# Altium project Charging_PCB.PrjPcb (part 2 of 2)

## Sheet 7-Latching IMD.SchDoc
size A
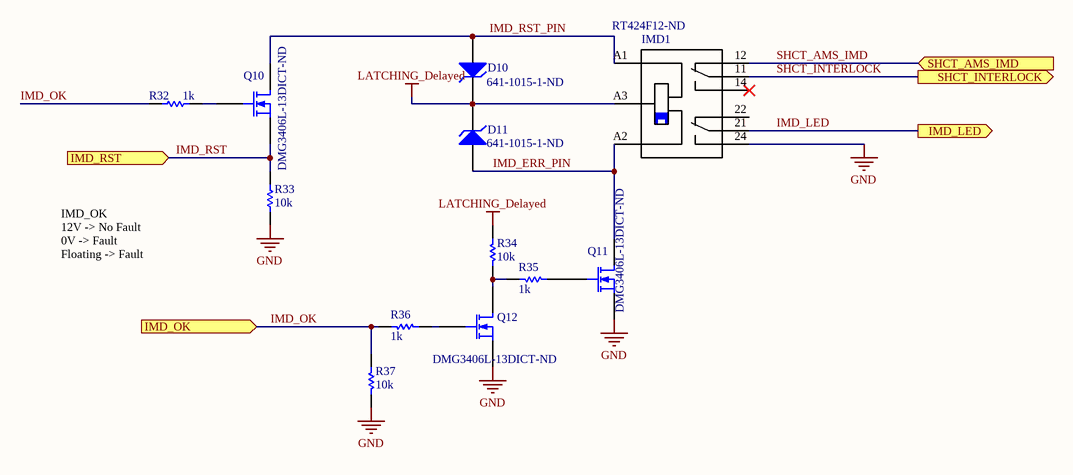
[diagram p6: 7-Latching IMD.SchDoc]

### Parts
D10  Supplier Part Number 1: 641-1015-1-ND  [DO214AC]  (hidden comment: D Zener)
D11  Supplier Part Number 1: 641-1015-1-ND  [DO214AC]  (hidden comment: D Zener)
IMD1  Supplier Part Number 1: RT424F12-ND  [TE_5-1393243-4]  (hidden comment: 5-1393243-4)
Q10  Supplier Part Number 1: DMG3406L-13DICT-ND  [SOT-23_N]
Q11  Supplier Part Number 1: DMG3406L-13DICT-ND  [SOT-23_N]
Q12  Supplier Part Number 1: DMG3406L-13DICT-ND  [SOT-23_N]
R32  value 1k  [1608[0603]]  (hidden comment: Res1)
R33  value 10k  [1608[0603]]  (hidden comment: Res1)
R34  Resistance (Ohms): 10k  [1608[0603]]  (hidden comment: RHM1.0KDCT-ND)
R35  value 1k  [1608[0603]]  (hidden comment: Res1)
R36  value 1k  [1608[0603]]  (hidden comment: Res1)
R37  value 10k  [1608[0603]]  (hidden comment: Res1)

### Ports
IMD_LED (out), IMD_OK (in), IMD_RST (in), SHCT_AMS_IMD (in), SHCT_INTERLOCK (out)

### Nets
GND: IMD1.24 Q11.2(S) Q12.2(S) R33.1 R37.2
LATCHING_Delayed: D10.2(K) D11.2(K) IMD1.A3 R34.1
IMD_ERR_PIN: D11.1(A) IMD1.A2 Q11.3(D)
IMD_LED: IMD1.21 ; port IMD_LED
IMD_OK: R32.1 R36.2 R37.1 ; port IMD_OK
IMD_RST: Q10.2(S) R33.2 ; port IMD_RST
IMD_RST_PIN: D10.1(A) IMD1.A1 Q10.3(D)
SHCT_AMS_IMD: IMD1.12 ; port SHCT_AMS_IMD
SHCT_INTERLOCK: IMD1.11 ; port SHCT_INTERLOCK
NetQ10_1: Q10.1(G) R32.2
NetQ11_1: Q11.1(G) R35.1
NetQ12_1: Q12.1(G) R36.1
NetQ12_3: Q12.3(D) R34.2 R35.2

Not connected (* = marked no-connect by the designer): IMD1 14* 22

### Notes on the sheet
- IMD_OK
  12V -> No Fault
  0V -> Fault
  Floating -> Fault

### Library data of the parts
D10 D11 = D Zener: Zener Diode; Published: 8-Jun-2000; LatestRevisionDate: 17-Jul-2002; LatestRevisionNote: Re-released for DXP Platform.; PackageReference: DIODE-0.7; Publisher: Altium Limited; PackageDescription: Diode, Thru-Hole; 2 Leads; 0.7 in Pin Spacing; Supplier 1: Digi-Key
IMD1 = 5-1393243-4: Electromechanical Relay 12VDC 240Ohm 15A DPDT __ 29mm 12.7mm 15.7mm__ THT Power Relay; MF: TE Connectivity; TE_purchase_URL: https://www.te.com/usa-en/product-5-1393243-4.html?te_bu=Cor&te_type=disp&te_campaign=seda_glo_cor-seda-global-disp-prtnr-fy19-seda-model-bom-cta_sma-317_1&elqCampaignId=32493; Package: None; MP: 5-1393243-4; Digi-Key_Purchase_URL: *; Digi-Key_Part_Number: *; SnapEDA_Link: https://www.snapeda.com/parts/5-1393243-4/TE%20Connectivity/view-part/?ref=snap; Value: *; Supplier 1: Digi-Key
Q10-Q12 = MOSFET-N: N-Channel MOSFET; Manufacturer: Infineon Technologies; FET Type: MOSFET N-Channel, Metal Oxide; FET Feature: Logic Level Gate; Drain to Source Voltage (Vdss): 30V; Current - Continuous Drain (Id) @ 25°C: 50A (Tc); Rds On (Max) @ Id, Vgs: 7.5 mOhm @ 30A, 10V; Vgs(th) (Max) @ Id: 2.2V @ 250µA; Gate Charge (Qg) @ Vgs: 18nC @ 10V; Input Capacitance (Ciss) @ Vds: 1900pF @ 15V; Power - Max: 47W; Published: 8-Jun-2000; LatestRevisionDate: 17-Jul-2002; LatestRevisionNote: Re-released for DXP Platform.; PackageVersion: 1995/1996; PackageReference: E3; Publisher: Altium Limited; PackageDescription: TO, Flat Index; 3 In-Line, Axial Leads; Body Dia. 4.6mm; Lead Dia. 0.5 mm (max); RoHS: RoHS Compliant; Category: Discrete Semiconductor Products; Packaging: Cut Tape (CT); Mounting Type: Surface Mount; Package / Case: TO-252-3, DPak (2 Leads + Tab), SC-63; Supplier Device Package: PG-TO252-3; ComponentLink1URL: http://www.infineon.com/dgdl/Infineon-IPD075N03LG-DS-v02_01-en.pdf?folderId=5546d4694909da4801490a07012f053b&fileId=db3a30431936bc4b011951d824f83aeb; ComponentLink1Description: http://www.infineon.com/dgdl/Infineon-IPD075N03LG-DS-v02_01-en.pdf?folderId=5546d4694909da4801490a07012f053b&fileId=db3a30431936bc4b011951d824f83aeb; ComponentLink2URL: http://www.semicon.toshiba.co.jp/info/docget.jsp?type=datasheet&lang=en&pid=SSM3K329R; ComponentLink2Description: http://www.semicon.toshiba.co.jp/info/docget.jsp?type=datasheet&lang=en&pid=SSM3K329R; Supplier 1: Digi-Key
R32 R35 R36 = Res1: RES SMD 100 OHM 5% 1/4W 0603; Manufacturer: Rohm Semiconductor; Manufacturer Part Number: ESR03EZPJ101; Resistance (Ohms): 100; Power (Watts): 0.25W, 1/4W; Temperature Coefficient: ±200ppm/°C; Published: 8-Jun-2000; LatestRevisionDate: 17-Jul-2002; LatestRevisionNote: Re-released for DXP Platform.; PackageReference: AXIAL-0.3; Publisher: Altium Limited; PackageDescription: Axial Device, Thru-Hole; 2 Leads; 0.3 in Pin Spacing; Supplier 1: Digi-Key; Supplier Part Number 1: RHM100DCT-ND; RoHS: RoHS Compliant; Category: Resistors; Stock 1: 57430; Pricing 1: 1=0.15, 10=0.119, 25=0.0824, 50=0.0642, 100=0.0458, 250=0.03568, 500=0.02836, 1000=0.02012 (CAD); Packaging: Cut Tape (CT); Part Status: Active; Tolerance: ±5%; Composition: Thick Film; Features: Automotive AEC-Q200, Pulse Withstanding; Operating Temperature: -55°C ~ 155°C; Package / Case: 0603 (1608 Metric); Supplier Device Package: 0603; Size / Dimension: 0.063" L x 0.031" W (1.60mm x 0.80mm); Height - Seated (Max): 0.022" (0.55mm); Failure Rate: -; ComponentLink1URL: http://rohmfs.rohm.com/en/products/databook/datasheet/passive/resistor/chip_resistor/esr.pdf; ComponentLink1Description: http://rohmfs.rohm.com/en/products/databook/datasheet/passive/resistor/chip_resistor/esr.pdf
R33 = Res1: RES SMD 10K OHM 5% 1/4W 0603; Manufacturer: Rohm Semiconductor; Manufacturer Part Number: ESR03EZPJ103; Power (Watts): 0.25W, 1/4W; Temperature Coefficient: ±200ppm/°C; Published: 8-Jun-2000; LatestRevisionDate: 17-Jul-2002; LatestRevisionNote: Re-released for DXP Platform.; PackageReference: AXIAL-0.3; Publisher: Altium Limited; PackageDescription: Axial Device, Thru-Hole; 2 Leads; 0.3 in Pin Spacing; Supplier 1: Digi-Key; Supplier Part Number 1: RHM10KDCT-ND; RoHS: RoHS Compliant; Category: Resistors; Stock 1: 0; Pricing 1: 1=0.15, 10=0.119, 25=0.0824, 50=0.0642, 100=0.0458, 250=0.03568, 500=0.02836, 1000=0.02012 (CAD); Packaging: Cut Tape (CT); Resistance (Ohms): 10k; Tolerance: ±5%; Composition: Thick Film; Features: Automotive AEC-Q200, Pulse Withstanding; Operating Temperature: -55°C ~ 155°C; Package / Case: 0603 (1608 Metric); Supplier Device Package: 0603 (1608 Metric); Size / Dimension: 0.063" L x 0.031" W (1.60mm x 0.80mm); Height: 0.022" (0.55mm); Number of Terminations: 2; ComponentLink1URL: http://rohmfs.rohm.com/en/products/databook/datasheet/passive/resistor/chip_resistor/esr.pdf; ComponentLink1Description: http://rohmfs.rohm.com/en/products/databook/datasheet/passive/resistor/chip_resistor/esr.pdf; Part Status: Active; Height - Seated (Max): 0.022" (0.55mm); Failure Rate: -
R34 = Res1: RES SMD 1.0K OHM 5% 1/4W 0603; Manufacturer: Rohm Semiconductor; Manufacturer Part Number: ESR03EZPJ102; Power (Watts): 0.25W, 1/4W; Temperature Coefficient: ±200ppm/°C; Supplier 1: Digi-Key; Supplier Part Number 1: RHM1.0KDCT-ND; RoHS: RoHS Compliant; Category: Resistors; Stock 1: 220; Pricing 1: 1=0.15, 10=0.119, 25=0.0824, 50=0.0642, 100=0.0458, 250=0.03568, 500=0.02836, 1000=0.02012 (CAD); Packaging: Cut Tape (CT); Part Status: Active; Tolerance: ±5%; Composition: Thick Film; Features: Automotive AEC-Q200, Pulse Withstanding; Operating Temperature: -55°C ~ 155°C; Package / Case: 0603 (1608 Metric); Supplier Device Package: 0603; Size / Dimension: 0.063" L x 0.031" W (1.60mm x 0.80mm); Height - Seated (Max): 0.022" (0.55mm); Failure Rate: -; ComponentLink1URL: http://rohmfs.rohm.com/en/products/databook/datasheet/passive/resistor/chip_resistor/esr.pdf; ComponentLink1Description: http://rohmfs.rohm.com/en/products/databook/datasheet/passive/resistor/chip_resistor/esr.pdf
R37 = Res1: RES SMD 2.2K OHM 5% 1/4W 0603; Manufacturer: Rohm Semiconductor; Manufacturer Part Number: ESR03EZPJ222; Power (Watts): 0.25W, 1/4W; Temperature Coefficient: ±200ppm/°C; Published: 8-Jun-2000; LatestRevisionDate: 17-Jul-2002; LatestRevisionNote: Re-released for DXP Platform.; PackageReference: AXIAL-0.3; Publisher: Altium Limited; PackageDescription: Axial Device, Thru-Hole; 2 Leads; 0.3 in Pin Spacing; Supplier 1: Digi-Key; Supplier Part Number 1: RHM2.2KDCT-ND; RoHS: RoHS Compliant; Category: Resistors; Stock 1: 17564; Pricing 1: 1=0.15, 10=0.121, 25=0.0832, 100=0.0463, 250=0.03604, 500=0.02866, 1000=0.02033 (CAD); Packaging: Cut Tape (CT); Resistance (Ohms): 2.2k; Tolerance: ±5%; Composition: Thick Film; Features: Automotive AEC-Q200, Pulse Withstanding; Operating Temperature: -55°C ~ 155°C; Package / Case: 0603 (1608 Metric); Supplier Device Package: 0603 (1608 Metric); Size / Dimension: 0.063" L x 0.031" W (1.60mm x 0.80mm); Height: 0.022" (0.55mm); Number of Terminations: 2; ComponentLink1URL: http://rohmfs.rohm.com/en/products/databook/datasheet/passive/resistor/chip_resistor/esr.pdf; ComponentLink1Description: http://rohmfs.rohm.com/en/products/databook/datasheet/passive/resistor/chip_resistor/esr.pdf

## Sheet 8-Controller.SchDoc
size A; SPICEModelCacheDTLPPUMU: <root> / <DocumentId>DTLPPUMU</DocumentId> / <CacheFrame Number="0"> / <Model Name="xtal" Kind="CKT"> / <Text>*Generic type:crystal pkg:HC33/51 / .SUBCKT XTAL 1 2 PARAMS: FREQ=1Meg RS=750 C=13pf Q=1000 / LX 1 3 {((Q*RS)/(6.2831852*FREQ))} IC=0.5M / CX 3 4 {(1/(Q*6.2831852*FREQ*RS))} / C0 1 2 {C} / RS 4 2 {RS} / .ENDS XTAL</Text> / </Model> / </CacheFrame> / </root>
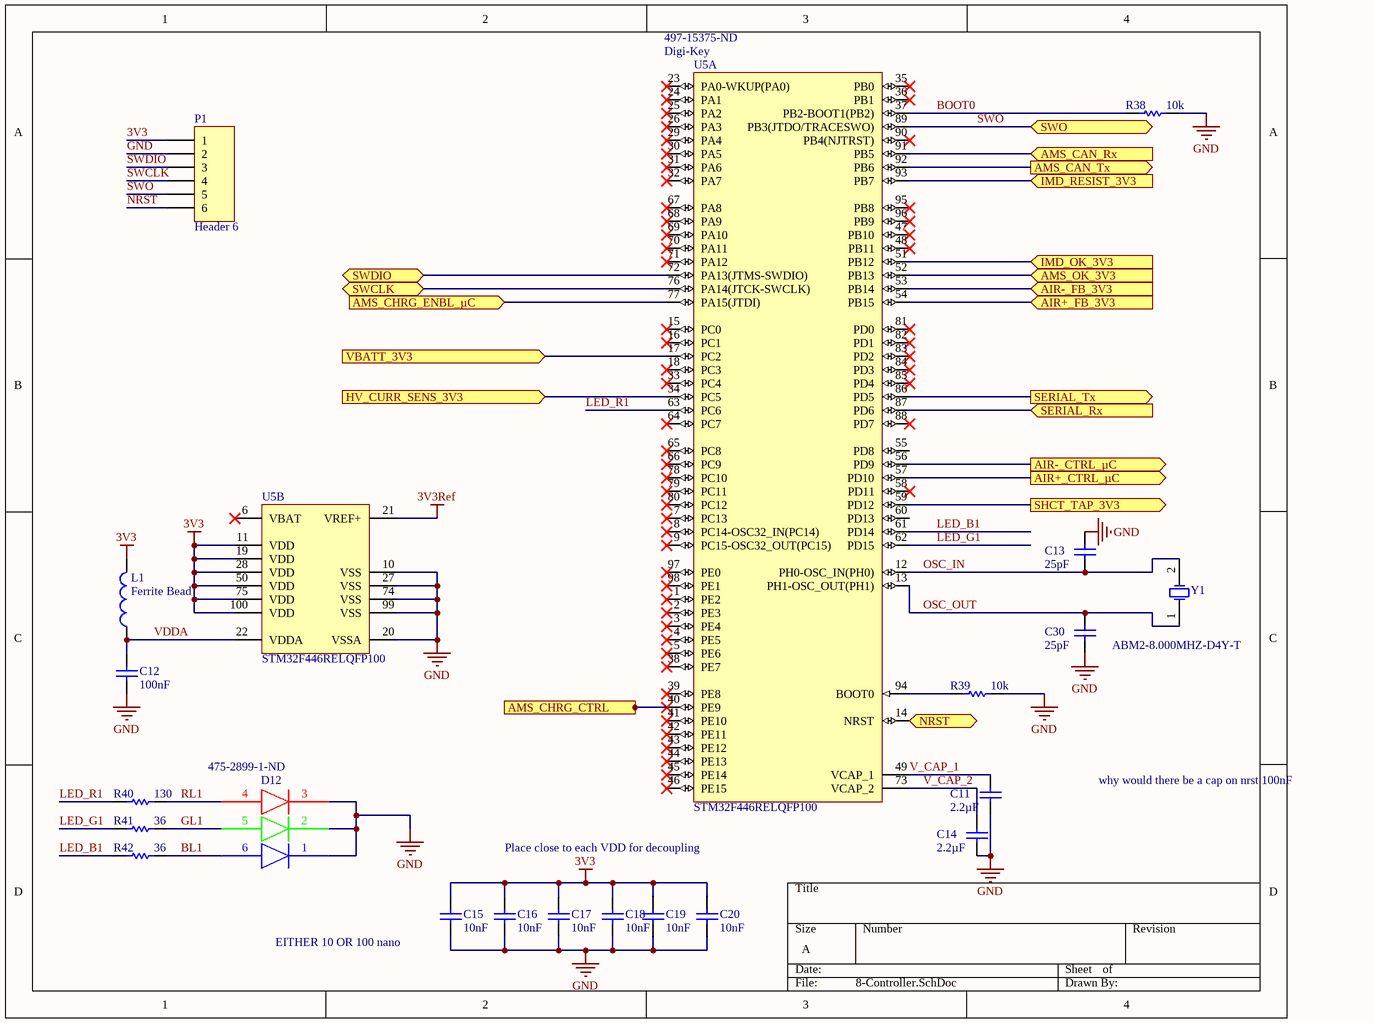
[diagram p7: 8-Controller.SchDoc]

### Parts
C11  Capacitance: 2.2µF  [1608[0603]]  (hidden comment: Cap)
C12  value 100nF  [1608[0603]]  (hidden comment: Cap)
C13  Capacitance: 25pF  [1608[0603]]  (hidden comment: Cap)
C14  Capacitance: 2.2µF  [1608[0603]]  (hidden comment: Cap)
C15  value 10nF  [1608[0603]]  (hidden comment: Cap)
C16  value 10nF  [1608[0603]]  (hidden comment: Cap)
C17  value 10nF  [1608[0603]]  (hidden comment: Cap)
C18  value 10nF  [1608[0603]]  (hidden comment: Cap)
C19  value 10nF  [1608[0603]]  (hidden comment: Cap)
C20  value 10nF  [1608[0603]]  (hidden comment: Cap)
C30  Capacitance: 25pF  [1608[0603]]  (hidden comment: Cap)
D12  Supplier Part Number 1: 475-2899-1-ND  [CLX6C-FKB]
L1  Ferrite Bead  [1608[0603]]
P1  Header 6  [HDR1X6]
R38  value 10k  [1608[0603]]  (hidden comment: Res1)
R39  value 10k  [1608[0603]]  (hidden comment: Res1)
R40  value 130  [1608[0603]]  (hidden comment: Res1)
R41  value 36  [1608[0603]]  (hidden comment: Res1)
R42  value 36  [1608[0603]]  (hidden comment: Res1)
U5  STM32F446RELQFP100  Supplier 1: Digi-Key  Supplier Part Number 1: 497-15375-ND  [STM-LQFP100_L]  (parts A,B of 2)
Y1  ABM2-8.000MHZ-D4Y-T  [ABM2-8.000MHZ-D4Y-T]

### Ports
AIR+_CTRL_µC (out), AIR+_FB_3V3 (in), AIR-_CTRL_µC (out), AIR-_FB_3V3 (in), AMS_CAN_Rx (in), AMS_CAN_Tx (out), AMS_CHRG_CTRL (in), AMS_CHRG_ENBL_µC (in), AMS_OK_3V3 (in), HV_CURR_SENS_3V3 (in), IMD_OK_3V3 (in), IMD_RESIST_3V3 (in), NRST (bidir), SERIAL_Rx (in), SERIAL_Tx (out), SHCT_TAP_3V3 (out), SWCLK (bidir), SWDIO (bidir), SWO (bidir), VBATT_3V3 (in)

### Nets
3V3: C15.2 C16.2 C17.2 C18.2 C19.2 C20.2 L1.2 P1.1 U5.11(VDD) U5.19(VDD) U5.28(VDD) U5.50(VDD) U5.75(VDD) U5.100(VDD)
3V3Ref: U5.21(VREF+)
GND: C11.1 C12.1 C13.2 C14.1 C15.1 C16.1 C17.1 C18.1 C19.1 C20.1 C30.1 D12.1(B) D12.2(G) D12.3(R) P1.2 R38.2 R39.2 U5.10(VSS) U5.20(VSSA) U5.27(VSS) U5.74(VSS) U5.99(VSS)
AMS_CHRG_CTRL: U5.40(PE9) ; port AMS_CHRG_CTRL
BL1: D12.6(B) R42.2
BOOT0: R38.1 U5.37(PB2-BOOT1(PB2))
GL1: D12.5(G) R41.2
LED_B1: R42.1 U5.61(PD14)
LED_G1: R41.1 U5.62(PD15)
LED_R1: R40.1 U5.63(PC6)
NRST: P1.6 U5.14(NRST) ; port NRST
OSC_IN: C13.1 U5.12(PH0-OSC_IN(PH0)) Y1.2(OSC2)
OSC_OUT: C30.2 U5.13(PH1-OSC_OUT(PH1)) Y1.1(OSC1)
RL1: D12.4(R) R40.2
Serial_Rx: U5.87(PD6) ; port SERIAL_Rx
Serial_Tx: U5.86(PD5) ; port SERIAL_Tx
SWCLK: P1.4 U5.76(PA14(JTCK-SWCLK)) ; port SWCLK
SWDIO: P1.3 U5.72(PA13(JTMS-SWDIO)) ; port SWDIO
SWO: P1.5 U5.89(PB3(JTDO/TRACESWO)) ; port SWO
V_CAP_1: C11.2 U5.49(VCAP_1)
V_CAP_2: C14.2 U5.73(VCAP_2)
VDDA: C12.2 L1.1 U5.22(VDDA)
NetC21_2: U5.34(PC5) ; port HV_CURR_SENS_3V3
NetC22_2: U5.51(PB12) ; port IMD_OK_3V3
NetC23_2: U5.52(PB13) ; port AMS_OK_3V3
NetC24_2: U5.93(PB7) ; port IMD_RESIST_3V3
NetC25_2: U5.17(PC2) ; port VBATT_3V3
NetC26_2: U5.59(PD12) ; port SHCT_TAP_3V3
NetC27_2: U5.54(PB15) ; port AIR+_FB_3V3
NetC28_2: U5.53(PB14) ; port AIR-_FB_3V3
NetR13_1: U5.57(PD10) ; port AIR+_CTRL_µC
NetR15_1: U5.56(PD9) ; port AIR-_CTRL_µC
NetR39_1: R39.1 U5.94(BOOT0)
NetU5_77: U5.77(PA15(JTDI)) ; port AMS_CHRG_ENBL_µC
NetU5_91: U5.91(PB5) ; port AMS_CAN_Rx
NetU5_92: U5.92(PB6) ; port AMS_CAN_Tx

Not connected (* = marked no-connect by the designer): U5 1(PE2)* 2(PE3)* 3(PE4)* 4(PE5)* 5(PE6)* 6(VBAT)* 7(PC13)* 8(PC14-OSC32_IN(PC14))* 9(PC15-OSC32_OUT(PC15))* 15(PC0)* 16(PC1)* 18(PC3)* 23(PA0-WKUP(PA0))* 24(PA1)* 25(PA2)* 26(PA3)* 29(PA4)* 30(PA5)* 31(PA6)* 32(PA7)* 33(PC4)* 35(PB0)* 36(PB1)* 38(PE7)* 39(PE8)* 41(PE10)* 42(PE11)* 43(PE12)* 44(PE13)* 45(PE14)* 46(PE15)* 47(PB10)* 48(PB11)* 55(PD8) 58(PD11)* 60(PD13) 64(PC7)* 65(PC8)* 66(PC9)* 67(PA8)* 68(PA9)* 69(PA10)* 70(PA11)* 71(PA12)* 78(PC10)* 79(PC11)* 80(PC12)* 81(PD0)* 82(PD1)* 83(PD2)* 84(PD3)* 85(PD4)* 88(PD7)* 90(PB4(NJTRST))* 95(PB8)* 96(PB9)* 97(PE0)* 98(PE1)*

### Notes on the sheet
- why would there be a cap on nrst 100nF
- Place close to each VDD for decoupling
- (near C15) EITHER 10 OR 100 nano

### Library data of the parts
C11 C13 C14 C30 = Cap: Capacitor; Manufacturer: Taiyo Yuden; Manufacturer Part Number: TMK107BBJ225KAHT; Tolerance: ±10%; Voltage - Rated: 25V; Temperature Coefficient: X5R; Category: Capacitors; Applications: General Purpose; Supplier 1: Digi-Key; Supplier Part Number 1: 587-4333-1-ND; RoHS: RoHS Compliant; Stock 1: 6587; Pricing 1: 1=0.28, 10=0.193, 25=0.1416, 50=0.116, 100=0.0979, 250=0.07992, 500=0.06702, 1000=0.05928 (CAD); Packaging: Cut Tape (CT); Part Status: Active; Operating Temperature: -55°C ~ 85°C; Features: -; Ratings: AEC-Q200; Mounting Type: Surface Mount, MLCC; Package / Case: 0603 (1608 Metric); Size / Dimension: 0.063" L x 0.031" W (1.60mm x 0.80mm); Height - Seated (Max): -; Thickness (Max): 0.035" (0.90mm); Lead Spacing: -; Lead Style: -; ComponentLink1URL: http://www.yuden.co.jp/productdata/catalog/en/mlcc_all_hq_e.pdf; ComponentLink1Description: http://www.yuden.co.jp/productdata/catalog/en/mlcc_all_hq_e.pdf
C12 = Cap: Capacitor; Manufacturer: Yageo; Manufacturer Part Number: CC0603KRX7R9BB104; Capacitance: 0.10µF; Tolerance: ±10%; Voltage - Rated: 50V; Temperature Coefficient: X7R; Supplier 1: Digi-Key; Supplier Part Number 1: 311-1344-1-ND; RoHS: RoHS Compliant; Category: Capacitors; Stock 1: 4016262; Pricing 1: 1=0.15, 10=0.043, 25=0.0312, 50=0.0232, 100=0.0189, 250=0.0158, 500=0.01346, 1000=0.01059 (CAD); Packaging: Cut Tape (CT); Part Status: Active; Operating Temperature: -55°C ~ 125°C; Features: -; Ratings: -; Applications: General Purpose; Failure Rate: -; Mounting Type: Surface Mount, MLCC; Package / Case: 0603 (1608 Metric); Size / Dimension: 0.063" L x 0.031" W (1.60mm x 0.80mm); Height - Seated (Max): -; Thickness (Max): 0.035" (0.90mm); Lead Spacing: -; Lead Style: -; ComponentLink1URL: http://www.yageo.com/documents/recent/UPY-GPHC_X7R_6.3V-to-50V_16.pdf; ComponentLink1Description: http://www.yageo.com/documents/recent/UPY-GPHC_X7R_6.3V-to-50V_16.pdf
C15-C20 = Cap: Capacitor; Manufacturer: Yageo; Manufacturer Part Number: CC0603KRX7R9BB103; Capacitance: 10000pF; Tolerance: ±10%; Voltage - Rated: 50V; Temperature Coefficient: X7R; Supplier 1: Digi-Key; Supplier Part Number 1: 311-1085-1-ND; RoHS: RoHS Compliant; Category: Capacitors; Stock 1: 3577285; Pricing 1: 1=0.15, 10=0.026, 25=0.0192, 50=0.0144, 100=0.0117, 250=0.0098, 500=0.00836, 1000=0.00657 (CAD); Packaging: Cut Tape (CT); Part Status: Active; Operating Temperature: -55°C ~ 125°C; Features: -; Ratings: -; Applications: General Purpose; Failure Rate: -; Mounting Type: Surface Mount, MLCC; Package / Case: 0603 (1608 Metric); Size / Dimension: 0.063" L x 0.031" W (1.60mm x 0.80mm); Height - Seated (Max): -; Thickness (Max): 0.035" (0.90mm); Lead Spacing: -; Lead Style: -; ComponentLink1URL: http://www.yageo.com/documents/recent/UPY-GPHC_X7R_6.3V-to-50V_16.pdf; ComponentLink1Description: http://www.yageo.com/documents/recent/UPY-GPHC_X7R_6.3V-to-50V_16.pdf
D12 = LED - CLX6C-FKB-CGJKNCFBB789363 RGB: Manufacturer: Cree Inc.; Color: Red, Green, Blue (RGB); Lens Color: White; Lens Transparency: Diffused; Millicandela Rating: 420mcd Red, 840mcd Green, 196mcd Blue; Lens Style/Size: Square with Flat Top, 1.00mm; Voltage - Forward (Vf) (Typ): 1.9V Red, 3V Green, 3V Blue; Current - Test: 8mA Red, 8mA Green, 8mA Blue; Wavelength - Dominant: 622nm Red, 531nm Green, 470nm Blue; Manufacturer Part Number: CLX6C-FKB-CGJKNCFBB789363; RoHS: RoHS Compliant; Category: Optoelectronics; Packaging: Cut Tape (CT); Part Status: Active; Viewing Angle: -; Mounting Type: Surface Mount; Wavelength - Peak: -; Features: -; Package / Case: 6-SMD, J-Lead; Supplier Device Package: 6-PLCC; Size / Dimension: 3.40mm L x 3.40mm W; Height (Max): 2.90mm; ComponentLink1URL: http://www.cree.com/~/media/Files/Cree/LED-Components-and-Modules/HB/Data-Sheets/1281-CLX6C-FKB.pdf; ComponentLink1Description: http://www.cree.com/~/media/Files/Cree/LED-Components-and-Modules/HB/Data-Sheets/1281-CLX6C-FKB.pdf; Supplier 1: Digi-Key
L1 = Inductor: Code_IEC: 1005; Published: 8-Jun-2000; LatestRevisionDate: 29-May-2009; LatestRevisionNote: IPC-7351 Footprint Added.; PackageReference: 0402-A; Publisher: Altium Limited; PackageDescription: Chip Inductor; Code_JEITA: 0402; Supplier 1: Digi-Key; Supplier Part Number 1: 240-2369-1-ND
P1 = Header 6: Header, 6-Pin; LatestRevisionDate: 17-Jul-2002; LatestRevisionNote: Re-released for DXP Platform.; Publisher: Altium Limited
R38 R39 = Res1: Resistor; Manufacturer: Yageo; Manufacturer Part Number: RC0603JR-0710KL; Tolerance: ±5%; Power (Watts): 0.1W, 1/10W; Temperature Coefficient: ±100ppm/°C; Supplier 1: Digi-Key; Supplier Part Number 1: 311-10KGRCT-ND; RoHS: RoHS Compliant; Category: Resistors; Stock 1: 2936292; Pricing 1: 1=0.16, 10=0.016, 25=0.0112, 50=0.0084, 100=0.0062, 250=0.0048, 500=0.00382, 1000=0.00281 (CAD); Packaging: Cut Tape (CT); Part Status: Active; Resistance (Ohms): 10k; Composition: Thick Film; Features: Moisture Resistant; Operating Temperature: -55°C ~ 155°C; Package / Case: 0603 (1608 Metric); Supplier Device Package: 0603; Size / Dimension: 0.063" L x 0.031" W (1.60mm x 0.80mm); Height - Seated (Max): 0.022" (0.55mm); Number of Terminations: 2; Failure Rate: -; ComponentLink1URL: http://www.yageo.com/NewPortal/yageodocoutput?fileName=/pdf/R-Chip/PYu-RC_Group_51_RoHS_L_4.pdf; ComponentLink1Description: http://www.yageo.com/NewPortal/yageodocoutput?fileName=/pdf/R-Chip/PYu-RC_Group_51_RoHS_L_4.pdf
R40 = Res1: Resistor; Manufacturer: Yageo; Manufacturer Part Number: RC0603JR-07130RL; Tolerance: ±5%; Power (Watts): 0.1W, 1/10W; Temperature Coefficient: ±100ppm/°C; Supplier 1: Digi-Key; Supplier Part Number 1: 311-130GRCT-ND; RoHS: RoHS Compliant; Category: Resistors; Stock 1: 74185; Pricing 1: 1=0.16, 10=0.016, 25=0.0112, 50=0.0084, 100=0.0062, 250=0.0048, 500=0.00382, 1000=0.00281 (CAD); Packaging: Cut Tape (CT); Part Status: Active; Resistance (Ohms): 130; Composition: Thick Film; Features: Moisture Resistant; Operating Temperature: -55°C ~ 155°C; Package / Case: 0603 (1608 Metric); Supplier Device Package: 0603; Size / Dimension: 0.063" L x 0.031" W (1.60mm x 0.80mm); Height - Seated (Max): 0.022" (0.55mm); Number of Terminations: 2; Failure Rate: -; ComponentLink1URL: http://www.yageo.com/NewPortal/yageodocoutput?fileName=/pdf/R-Chip/PYu-RC_Group_51_RoHS_L_4.pdf; ComponentLink1Description: http://www.yageo.com/NewPortal/yageodocoutput?fileName=/pdf/R-Chip/PYu-RC_Group_51_RoHS_L_4.pdf
R41 R42 = Res1: Resistor; Manufacturer: Yageo; Manufacturer Part Number: RC0603JR-0736RL; Tolerance: ±5%; Power (Watts): 0.1W, 1/10W; Temperature Coefficient: ±100ppm/°C; Supplier 1: Digi-Key; Supplier Part Number 1: 311-36GRCT-ND; RoHS: RoHS Compliant; Category: Resistors; Stock 1: 43300; Pricing 1: 1=0.16, 10=0.016, 25=0.0112, 50=0.0084, 100=0.0062, 250=0.0048, 500=0.00382, 1000=0.00281 (CAD); Packaging: Cut Tape (CT); Part Status: Active; Resistance (Ohms): 36; Composition: Thick Film; Features: Moisture Resistant; Operating Temperature: -55°C ~ 155°C; Package / Case: 0603 (1608 Metric); Supplier Device Package: 0603; Size / Dimension: 0.063" L x 0.031" W (1.60mm x 0.80mm); Height - Seated (Max): 0.022" (0.55mm); Number of Terminations: 2; Failure Rate: -; ComponentLink1URL: http://www.yageo.com/NewPortal/yageodocoutput?fileName=/pdf/R-Chip/PYu-RC_Group_51_RoHS_L_4.pdf; ComponentLink1Description: http://www.yageo.com/NewPortal/yageodocoutput?fileName=/pdf/R-Chip/PYu-RC_Group_51_RoHS_L_4.pdf
U5 = CMP-0243-00042-2: ARM Cortex-M4 32-bit MCU+FPU, 225 DMIPS, 2048 kB Flash, 256 kB Internal RAM, 81 I/Os, 100-pin LQFP, -40 to 85 degC, Tray; PartNumber: STM32F439VIT6; Manufacturer: STMicroelectronics; Manufacturer Part Number: STM32F446VET6; FLASH Size (Prog) (kB): 2048; Supply Voltage(Vcc) max (V): 3.6; I/Os (High Current): 82; Supply Voltage(Vcc) min (V): 1.8; Operating Frequency(F) (Processor speed) (MHz): 180; Internal RAM Size (kB): 256; D/A Converter: 2x12-bit; Core Processor: ARM® Cortex®-M4; Speed: 180MHz; Connectivity: CAN, EBI/EMI, I²C, IrDA, LIN, SAI, SD, SPDIF-Rx, SPI, UART/USART, USB, USB OTG; Peripherals: Brown-out Detect/Reset, DMA, I²S, LVD, POR, PWM, WDT; Number of I/O: 81; Program Memory Size: 512KB (512K x 8); RAM Size: 128K x 8; Voltage - Supply (Vcc/Vdd): 1.7 V ~ 3.6 V; Data Converters: A/D 16x12b, D/A 2x12b; Rule: UNIONINDEX=0|RULEKIND=Clearance|NETSCOPE=DifferentNets|LAYERKIND=SameLayer|NAME=Schematic Clearance Constraint|GAP=10mil|GENERICCLEARANCE=10mil|IGNOREPADTOPADCLEARANCEINFOOTPRINT=FALSE|OBJECTCLEARANCES=ClearanceObj_Arc-ClearanceObj_Hole:0;ClearanceObj_Track-ClearanceObj_Hole:0;ClearanceObj_SMDPad-ClearanceObj_Hole:0;ClearanceObj_THPad-ClearanceObj_Hole:0;ClearanceObj_Via-ClearanceObj_Hole:0;ClearanceObj_Fill-ClearanceObj_Hole:0;ClearanceObj_Poly-ClearanceObj_Hole:0;ClearanceObj_Region-ClearanceObj_Hole:0;ClearanceObj_Text-ClearanceObj_Hole:0|UNIT=Imperial; Rule: UNIONINDEX=0|RULEKIND=Width|NETSCOPE=AnyNet|LAYERKIND=SameLayer|NAME=Schematic Width Constraint|MAXLIMIT=10mil|MINLIMIT=5mil|PREFEREDWIDTH=10mil|MIDLAYER1_MINWIDTH=10mil|MIDLAYER2_MINWIDTH=10mil|MIDLAYER3_MINWIDTH=10mil|MIDLAYER4_MINWIDTH=10mil|MIDLAYER5_MINWIDTH=10mil|MIDLAYER6_MINWIDTH=10mil|MIDLAYER7_MINWIDTH=10mil|MIDLAYER8_MINWIDTH=10mil|MIDLAYER9_MINWIDTH=10mil|MIDLAYER10_MINWIDTH=10mil|MIDLAYER11_MINWIDTH=10mil|MIDLAYER12_MINWIDTH=10mil|MIDLAYER13_MINWIDTH=10mil|MIDLAYER14_MINWIDTH=10mil|MIDLAYER15_MINWIDTH=10mil|MIDLAYER16_MINWIDTH=10mil|MIDLAYER17_MINWIDTH=10mil|MIDLAYER18_MINWIDTH=10mil|MIDLAYER19_MINWIDTH=10mil|MIDLAYER20_MINWIDTH=10mil|MIDLAYER21_MINWIDTH=10mil|MIDLAYER22_MINWIDTH=10mil|MIDLAYER23_MINWIDTH=10mil|MIDLAYER24_MINWIDTH=10mil|MIDLAYER25_MINWIDTH=10mil|MIDLAYER26_MINWIDTH=10mil|MIDLAYER27_MINWIDTH=10mil|MIDLAYER28_MINWIDTH=10mil|MIDLAYER29_MINWIDTH=10mil|MIDLAYER30_MINWIDTH=10mil|MINIMP=50.000000|MAXIMP=50.000000|FAVIMP=50.000000|UNIT=Imperial; Mounting Technology: Surface Mount; Packing: Tray; PackageReference: LQFP100; Core: ARM Cortex-M4; PackageVersion: Rev. 1, 06/2013; DatasheetVersion: Rev. 2; PackageDescription: 100-Pin Low Profile Quad Flat Package, 14 x 14 mm Body, 0.5 mm Pitch; PartId: 1; RoHS: RoHS Compliant; Category: Integrated Circuits (ICs); Stock 1: 560; Pricing 1: 1=14.71, 10=13.292, 100=11.0054, 500=9.58332, 1000=8.34676 (CAD); Packaging: Tray; Part Status: Active; Core Size: 32-Bit; Program Memory Type: FLASH; EEPROM Size: -; Oscillator Type: Internal; Operating Temperature: -40°C ~ 85°C (TA); Package / Case: 100-LQFP; Supplier Device Package: 100-LQFP (14x14); ComponentLink5Description: ACTUAL DATASHEET; ComponentLink5URL: https://www.st.com/content/ccc/resource/technical/document/datasheet/65/cb/75/50/53/d6/48/24/DM00141306.pdf/files/DM00141306.pdf/jcr:content/translations/en.DM00141306.pdf
Y1 = XTAL: Crystal Oscillator; Published: 8-Jun-2000; LatestRevisionDate: 17-Jul-2002; LatestRevisionNote: Re-released for DXP Platform.; PackageReference: R38; Publisher: Altium Limited; PackageDescription: Crystal, Thru-Hole; 2 Leads; Body 3.1 x 8.2 mm (Dia.xH)

## Sheet 9-Protections 1 of 2.SchDoc
size A
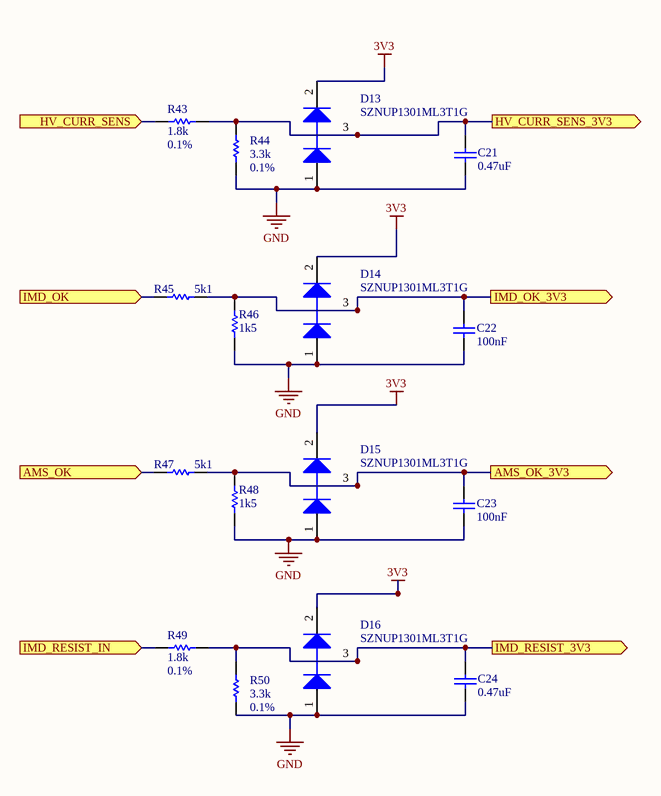
[diagram p8: 9-Protections 1 of 2.SchDoc]

### Parts
C21  value 0.47uF  [1608[0603]]  (hidden comment: Cap)
C22  value 100nF  [1608[0603]]  (hidden comment: Cap)
C23  value 100nF  [1608[0603]]  (hidden comment: Cap)
C24  value 0.47uF  [1608[0603]]  (hidden comment: Cap)
D13  SZNUP1301ML3T1G  [ONSC-SOT-23-3-318-08_V]
D14  SZNUP1301ML3T1G  [ONSC-SOT-23-3-318-08_V]
D15  SZNUP1301ML3T1G  [ONSC-SOT-23-3-318-08_V]
D16  SZNUP1301ML3T1G  [ONSC-SOT-23-3-318-08_V]
R43  value 1.8k  Tolerance: 0.1%  [1608[0603]]  (hidden comment: Res1)
R44  value 3.3k  Tolerance: 0.1%  [1608[0603]]  (hidden comment: Res1)
R45  value 5k1  [1608[0603]]  (hidden comment: Res1)
R46  value 1k5  [1608[0603]]  (hidden comment: Res1)
R47  value 5k1  [1608[0603]]  (hidden comment: Res1)
R48  value 1k5  [1608[0603]]  (hidden comment: Res1)
R49  value 1.8k  Tolerance: 0.1%  [1608[0603]]  (hidden comment: Res1)
R50  value 3.3k  Tolerance: 0.1%  [1608[0603]]  (hidden comment: Res1)

### Ports
AMS_OK (in), AMS_OK_3V3 (out), HV_CURR_SENS (in), HV_CURR_SENS_3V3 (out), IMD_OK (in), IMD_OK_3V3 (out), IMD_RESIST_3V3 (out), IMD_RESIST_IN (in)

### Nets
3V3: D13.2(K) D14.2(K) D15.2(K) D16.2(K)
GND: C21.1 C22.1 C23.1 C24.1 D13.1(A) D14.1(A) D15.1(A) D16.1(A) R44.1 R46.1 R48.1 R50.1
AMS_OK: R47.1 ; port AMS_OK
HV_CURR_SENS: R43.2 ; port HV_CURR_SENS
IMD_OK: R45.1 ; port IMD_OK
IMD_RESIST_IN: R49.2 ; port IMD_RESIST_IN
NetC21_2: C21.2 D13.3(K/A) R43.1 R44.2 ; port HV_CURR_SENS_3V3
NetC22_2: C22.2 D14.3(K/A) R45.2 R46.2 ; port IMD_OK_3V3
NetC23_2: C23.2 D15.3(K/A) R47.2 R48.2 ; port AMS_OK_3V3
NetC24_2: C24.2 D16.3(K/A) R49.1 R50.2 ; port IMD_RESIST_3V3

### Library data of the parts
C21 C24 = Cap: Capacitor; Manufacturer: Yageo; Manufacturer Part Number: CC0603KRX7R8BB474; Capacitance: 0.47µF; Tolerance: ±10%; Voltage - Rated: 25V; Temperature Coefficient: X7R; Supplier 1: Digi-Key; Supplier Part Number 1: 311-1805-1-ND; RoHS: RoHS Compliant; Category: Capacitors; Stock 1: 11076; Pricing 1: 1=0.22, 10=0.158, 25=0.1156, 50=0.0898, 100=0.0745, 250=0.06168, 500=0.05226, 1000=0.04324 (CAD); Packaging: Cut Tape (CT); Part Status: Active; Operating Temperature: -55°C ~ 125°C; Features: -; Ratings: -; Applications: General Purpose; Failure Rate: -; Mounting Type: Surface Mount, MLCC; Package / Case: 0603 (1608 Metric); Size / Dimension: 0.063" L x 0.031" W (1.60mm x 0.80mm); Height - Seated (Max): -; Thickness (Max): 0.035" (0.90mm); Lead Spacing: -; Lead Style: -; ComponentLink1URL: http://www.yageo.com/documents/recent/UPY-GPHC_X7R_6.3V-to-50V_16.pdf; ComponentLink1Description: http://www.yageo.com/documents/recent/UPY-GPHC_X7R_6.3V-to-50V_16.pdf
C22 C23 = Cap: as C12 on sheet 8-Controller; Supplier 1: Digi-Key; Supplier Part Number 1: 311-1344-1-ND; RoHS: RoHS Compliant; Category: Capacitors; Stock 1: 4016262; Pricing 1: 1=0.15, 10=0.043, 25=0.0312, 50=0.0232, 100=0.0189, 250=0.0158, 500=0.01346, 1000=0.01059 (CAD); Packaging: Cut Tape (CT); Part Status: Active; Operating Temperature: -55°C ~ 125°C; Features: -; Ratings: -; Applications: General Purpose; Failure Rate: -; Mounting Type: Surface Mount, MLCC; Package / Case: 0603 (1608 Metric); Size / Dimension: 0.063" L x 0.031" W (1.60mm x 0.80mm); Height - Seated (Max): -; Thickness (Max): 0.035" (0.90mm); Lead Spacing: -; Lead Style: -; ComponentLink1URL: http://www.yageo.com/documents/recent/UPY-GPHC_X7R_6.3V-to-50V_16.pdf; ComponentLink1Description: http://www.yageo.com/documents/recent/UPY-GPHC_X7R_6.3V-to-50V_16.pdf
D13-D16 = CMP-1063-00171-1: Low Capacitance Diode Array for ESD Protection in a Single Data Line, 3-Pin SOT-23, Pb-Free, Tape and Reel; Manufacturer: On Semiconductor; C Max (pF): 0.9; Direction: Bidirectional; V(BR) Min (V): 70; Number of Lines: 1; Mounting Technology: Surface Mount; PackageReference: SOT-23-3-318-08; DatasheetVersion: Rev. 6; PackageVersion: Rev. AP, 11/2009; RoHS: Pb-Free; ComponentLink1Description: Manufacturer URL; ComponentLink1URL: http://www.onsemi.com/; PackageDescription: 3-Pin Small Outline Transistor, Body 2.92 x 1.3 mm, Pitch 0.95 mm; PartNumber: SZNUP1301ML3T1G; Packing: Tape and Reel; ComponentLink3URL: http://www.onsemi.cn/pub_link/Collateral/318-08.PDF; ComponentLink3Description: Package Specification; VRWM Max (V): 70; ComponentLink2Description: Datasheet; ComponentLink2URL: http://www.onsemi.cn/pub_link/Collateral/NUP1301ML3T1-D.PDF
R43 R49 = Res1: Resistor; Manufacturer: Panasonic Electronic Components; Manufacturer Part Number: ERJ-PB6B1801V; Power (Watts): 0.25W, 1/4W; Temperature Coefficient: ±50ppm/°C; RoHS: RoHS Compliant; Category: Resistors; Stock 1: 4965; Pricing 1: 1=0.54, 10=0.461, 25=0.3348, 50=0.243, 100=0.1801, 250=0.13812, 500=0.10886, 1000=0.07537 (CAD); Packaging: Cut Tape (CT); Part Status: Active; Resistance (Ohms): 1.8k; Composition: Thick Film; Features: Automotive AEC-Q200, Pulse Withstanding; Operating Temperature: -55°C ~ 155°C; Package / Case: 0805 (2012 Metric); Supplier Device Package: 0805; Size / Dimension: 0.079" L x 0.049" W (2.00mm x 1.25mm); Height - Seated (Max): 0.028" (0.70mm); Failure Rate: -; ComponentLink1URL: https://industrial.panasonic.com/cdbs/www-data/pdf/RDM0000/AOA0000C100.pdf; ComponentLink1Description: https://industrial.panasonic.com/cdbs/www-data/pdf/RDM0000/AOA0000C100.pdf; Supplier 1: Digi-Key; Supplier Part Number 1: P20621CT-ND
R44 R50 = Res1: Resistor; Manufacturer: Panasonic Electronic Components; Manufacturer Part Number: ERJ-PB6B3301V; Power (Watts): 0.25W, 1/4W; Temperature Coefficient: ±50ppm/°C; RoHS: RoHS Compliant; Category: Resistors; Stock 1: 4675; Pricing 1: 1=0.54, 10=0.461, 25=0.3348, 50=0.243, 100=0.1801, 250=0.13812, 500=0.10886, 1000=0.07537 (CAD); Packaging: Cut Tape (CT); Part Status: Active; Resistance (Ohms): 3.3k; Composition: Thick Film; Features: Automotive AEC-Q200, Pulse Withstanding; Operating Temperature: -55°C ~ 155°C; Package / Case: 0805 (2012 Metric); Supplier Device Package: 0805; Size / Dimension: 0.079" L x 0.049" W (2.00mm x 1.25mm); Height - Seated (Max): 0.028" (0.70mm); Failure Rate: -; ComponentLink1URL: https://industrial.panasonic.com/cdbs/www-data/pdf/RDM0000/AOA0000C100.pdf; ComponentLink1Description: https://industrial.panasonic.com/cdbs/www-data/pdf/RDM0000/AOA0000C100.pdf; Supplier 1: Digi-Key; Supplier Part Number 1: P20651CT-ND
R45-R48 = Res1: Resistor; Manufacturer: Yageo; Manufacturer Part Number: RC0603JR-075K1L; Resistance (Ohms): 5.1k; Tolerance: ±5%; Power (Watts): 0.1W, 1/10W; Temperature Coefficient: ±100ppm/°C; Supplier 1: Digi-Key; RoHS: RoHS Compliant; Category: Resistors; Packaging: Cut Tape (CT); Part Status: Active; Composition: Thick Film; Features: Moisture Resistant; Operating Temperature: -55°C ~ 155°C; Package / Case: 0603 (1608 Metric); Supplier Device Package: 0603; Size / Dimension: 0.063" L x 0.031" W (1.60mm x 0.80mm); Height - Seated (Max): 0.022" (0.55mm); Number of Terminations: 2; Failure Rate: -; ComponentLink1URL: http://www.yageo.com/NewPortal/yageodocoutput?fileName=/pdf/R-Chip/PYu-RC_Group_51_RoHS_L_4.pdf; ComponentLink1Description: http://www.yageo.com/NewPortal/yageodocoutput?fileName=/pdf/R-Chip/PYu-RC_Group_51_RoHS_L_4.pdf
  R45 R47: Supplier Part Number 1: 311-5.1KGRCT-ND; Stock 1: 782184; Pricing 1: 1=0.16, 10=0.016, 25=0.0112, 50=0.0084, 100=0.0062, 250=0.0048, 500=0.00382, 1000=0.00281 (CAD)
  R46 R48: Supplier Part Number 1: 541-2789-1-ND; Stock 1: 14165; Pricing 1: 1=0.21, 10=0.192, 25=0.1332, 50=0.1038, 100=0.0741, 250=0.05776, 500=0.04586, 1000=0.03257 (CAD); ComponentLink2URL: http://www.vishay.com/docs/20065/rcse3.pdf; ComponentLink2Description: http://www.vishay.com/docs/20065/rcse3.pdf

## Sheet 10-Protections 2 of 2.SchDoc
size A
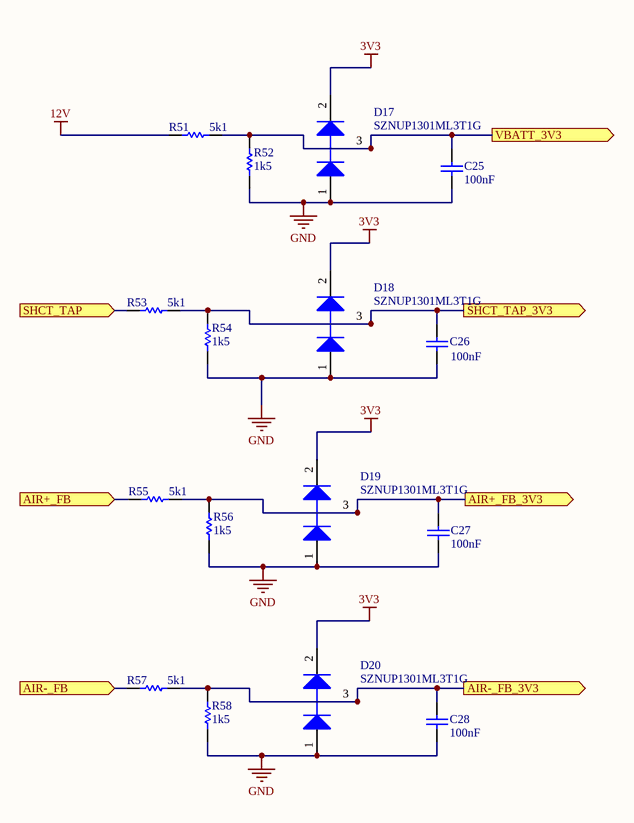
[diagram p9: 10-Protections 2 of 2.SchDoc]

### Parts
C25  value 100nF  [1608[0603]]  (hidden comment: Cap)
C26  value 100nF  [1608[0603]]  (hidden comment: Cap)
C27  value 100nF  [1608[0603]]  (hidden comment: Cap)
C28  value 100nF  [1608[0603]]  (hidden comment: Cap)
D17  SZNUP1301ML3T1G  [ONSC-SOT-23-3-318-08_V]
D18  SZNUP1301ML3T1G  [ONSC-SOT-23-3-318-08_V]
D19  SZNUP1301ML3T1G  [ONSC-SOT-23-3-318-08_V]
D20  SZNUP1301ML3T1G  [ONSC-SOT-23-3-318-08_V]
R51  value 5k1  [1608[0603]]  (hidden comment: Res1)
R52  value 1k5  [1608[0603]]  (hidden comment: Res1)
R53  value 5k1  [1608[0603]]  (hidden comment: Res1)
R54  value 1k5  [1608[0603]]  (hidden comment: Res1)
R55  value 5k1  [1608[0603]]  (hidden comment: Res1)
R56  value 1k5  [1608[0603]]  (hidden comment: Res1)
R57  value 5k1  [1608[0603]]  (hidden comment: Res1)
R58  value 1k5  [1608[0603]]  (hidden comment: Res1)

### Ports
AIR+_FB (in), AIR+_FB_3V3 (out), AIR-_FB (in), AIR-_FB_3V3 (out), SHCT_TAP (in), SHCT_TAP_3V3 (out), VBATT_3V3 (out)

### Nets
3V3: D17.2(K) D18.2(K) D19.2(K) D20.2(K)
12V: R51.1
GND: C25.1 C26.1 C27.1 C28.1 D17.1(A) D18.1(A) D19.1(A) D20.1(A) R52.1 R54.1 R56.1 R58.1
AIR+_FB: R55.1 ; port AIR+_FB
AIR-_FB: R57.1 ; port AIR-_FB
SHCT_TAP: R53.1 ; port SHCT_TAP
NetC25_2: C25.2 D17.3(K/A) R51.2 R52.2 ; port VBATT_3V3
NetC26_2: C26.2 D18.3(K/A) R53.2 R54.2 ; port SHCT_TAP_3V3
NetC27_2: C27.2 D19.3(K/A) R55.2 R56.2 ; port AIR+_FB_3V3
NetC28_2: C28.2 D20.3(K/A) R57.2 R58.2 ; port AIR-_FB_3V3

### Library data of the parts
C25-C28 = Cap: as C12 on sheet 8-Controller; Supplier 1: Digi-Key; Supplier Part Number 1: 311-1344-1-ND; RoHS: RoHS Compliant; Category: Capacitors; Stock 1: 4016262; Pricing 1: 1=0.15, 10=0.043, 25=0.0312, 50=0.0232, 100=0.0189, 250=0.0158, 500=0.01346, 1000=0.01059 (CAD); Packaging: Cut Tape (CT); Part Status: Active; Operating Temperature: -55°C ~ 125°C; Features: -; Ratings: -; Applications: General Purpose; Failure Rate: -; Mounting Type: Surface Mount, MLCC; Package / Case: 0603 (1608 Metric); Size / Dimension: 0.063" L x 0.031" W (1.60mm x 0.80mm); Height - Seated (Max): -; Thickness (Max): 0.035" (0.90mm); Lead Spacing: -; Lead Style: -; ComponentLink1URL: http://www.yageo.com/documents/recent/UPY-GPHC_X7R_6.3V-to-50V_16.pdf; ComponentLink1Description: http://www.yageo.com/documents/recent/UPY-GPHC_X7R_6.3V-to-50V_16.pdf
D17-D20 = CMP-1063-00171-1: as D13 on sheet 9-Protections 1 of 2; Mounting Technology: Surface Mount; PackageReference: SOT-23-3-318-08; DatasheetVersion: Rev. 6; PackageVersion: Rev. AP, 11/2009; RoHS: Pb-Free; ComponentLink1Description: Manufacturer URL; ComponentLink1URL: http://www.onsemi.com/; PackageDescription: 3-Pin Small Outline Transistor, Body 2.92 x 1.3 mm, Pitch 0.95 mm; PartNumber: SZNUP1301ML3T1G; Packing: Tape and Reel; ComponentLink3URL: http://www.onsemi.cn/pub_link/Collateral/318-08.PDF; ComponentLink3Description: Package Specification; VRWM Max (V): 70; ComponentLink2Description: Datasheet; ComponentLink2URL: http://www.onsemi.cn/pub_link/Collateral/NUP1301ML3T1-D.PDF
R51-R58 = Res1: as R45 on sheet 9-Protections 1 of 2; Supplier 1: Digi-Key; RoHS: RoHS Compliant; Category: Resistors; Packaging: Cut Tape (CT); Part Status: Active; Composition: Thick Film; Features: Moisture Resistant; Operating Temperature: -55°C ~ 155°C; Package / Case: 0603 (1608 Metric); Supplier Device Package: 0603; Size / Dimension: 0.063" L x 0.031" W (1.60mm x 0.80mm); Height - Seated (Max): 0.022" (0.55mm); Number of Terminations: 2; Failure Rate: -; ComponentLink1URL: http://www.yageo.com/NewPortal/yageodocoutput?fileName=/pdf/R-Chip/PYu-RC_Group_51_RoHS_L_4.pdf; ComponentLink1Description: http://www.yageo.com/NewPortal/yageodocoutput?fileName=/pdf/R-Chip/PYu-RC_Group_51_RoHS_L_4.pdf
  R51 R53 R55 R57: Supplier Part Number 1: 311-5.1KGRCT-ND; Stock 1: 782184; Pricing 1: 1=0.16, 10=0.016, 25=0.0112, 50=0.0084, 100=0.0062, 250=0.0048, 500=0.00382, 1000=0.00281 (CAD)
  R52 R54 R56 R58: Supplier Part Number 1: 541-2789-1-ND; Stock 1: 14165; Pricing 1: 1=0.21, 10=0.192, 25=0.1332, 50=0.1038, 100=0.0741, 250=0.05776, 500=0.04586, 1000=0.03257 (CAD); ComponentLink2URL: http://www.vishay.com/docs/20065/rcse3.pdf; ComponentLink2Description: http://www.vishay.com/docs/20065/rcse3.pdf

## Sheet 12-Charging LED Indicator.SchDoc
size A
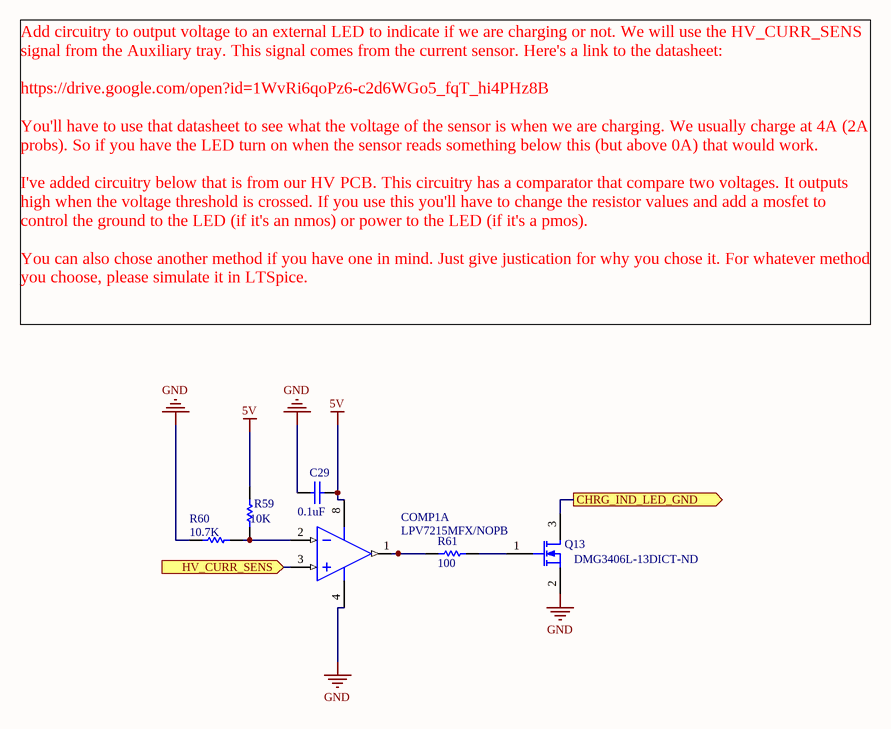
[diagram p10: 12-Charging LED Indicator.SchDoc]

### Parts
C29  0.1uF  [1206 (3216 Metric)]
COMP1  LPV7215MFX/NOPB  [SOIC-SN8_M]  (part A of 2)
Q13  Supplier Part Number 1: DMG3406L-13DICT-ND  [SOT-23_N]
R59  10K  [1206 (3216 Metric)]
R60  10.7K  [1206 (3216 Metric)]
R61  100  [1206 (3216 Metric)]

### Ports
CHRG_IND_LED_GND (out), HV_CURR_SENS (in)

### Nets
5V: C29.2 COMP1.8(VDD) R59.1
GND: C29.1 COMP1.4(VSS) Q13.2(S) R60.1
HV_CURR_SENS: COMP1.3(INA+) ; port HV_CURR_SENS
NetCOMP1_1: COMP1.1(OUTA) R61.1
NetCOMP1_2: COMP1.2(INA-) R59.2 R60.2
NetFRONT_PANEL_14: Q13.3(D) ; port CHRG_IND_LED_GND
NetQ13_1: Q13.1(G) R61.2

### Notes on the sheet
- Add circuitry to output voltage to an external LED to indicate if we are charging or not. We will use the HV_CURR_SENS signal from the Auxiliary tray. This signal comes from the current sensor. Here's a link to the datasheet:
  https://drive.google.com/open?id=1WvRi6qoPz6-c2d6WGo5_fqT_hi4PHz8B
  You'll have to use that datasheet to see what the voltage of the sensor is when we are charging. We usually charge at 4A (2A probs). So if you have the LED turn on when the sensor reads something below this (but above 0A) that would work.
  I've added circuitry below that is from our HV PCB. This circuitry has a comparator that compare two voltages. It outputs high when the voltage threshold is crossed. If you use this you'll have to change the resistor values and add a mosfet to control the ground to the LED (if it's an nmos) or power to the LED (if it's a pmos).
  You can also chose another method if you have one in mind. Just give justication for why you chose it. For whatever method you choose, please simulate it in LTSpice.

### Library data of the parts
C29 = Cap: CGA5L4X7T2W104M160AA: CAP CER 0.1UF 450V X7T 1206; Published: 8-Jun-2000; LatestRevisionDate: 17-Jul-2002; LatestRevisionNote: Re-released for DXP Platform.; PackageReference: RAD-0.3; Publisher: Altium Limited; PackageDescription: Radial Cap, Thru-Hole; 2 Leads; 0.3 in Pin Spacing; Value: 0.1uF; Supplier 1: Digi-Key; Supplier Part Number 1: 445-12959-1-ND
COMP1 = CMP-0187-00236-3: None; Quiescent Current: 130uA; Input Bias Current: 1pA; Min Supply Voltage: 1.8V; Propagation Delay: 80ns; Output Type: TTL; Number of Channels: 2; Power Supply Rejection Ratio (PSRR): 70dB; Input Offset Voltage (Vos): 10mV; Output Current: 50mA; Hysteresis: 5mV; Max Supply Voltage: 5.5V; Common Mode Rejection Ratio: 66dB; Number of Pins: 8; Packaging: Tape and Reel; Max Operating Temperature: 125°C; Technology: CMOS; Number of Elements: 2; Type: General Purpose; Package Quantity: 3300; Min Operating Temperature: -40°C; RoHS Compliant: Yes; Lead Free: Lead Free; Case/Package: SOIC; Mount: Surface Mount; Radiation Hardening: No
Q13 = MOSFET-N: N-Channel MOSFET; Manufacturer: Infineon Technologies; Manufacturer Part Number: IPD075N03L G; FET Type: MOSFET N-Channel, Metal Oxide; FET Feature: Logic Level Gate; Drain to Source Voltage (Vdss): 30V; Current - Continuous Drain (Id) @ 25°C: 50A (Tc); Rds On (Max) @ Id, Vgs: 7.5 mOhm @ 30A, 10V; Vgs(th) (Max) @ Id: 2.2V @ 250µA; Gate Charge (Qg) @ Vgs: 18nC @ 10V; Input Capacitance (Ciss) @ Vds: 1900pF @ 15V; Power - Max: 47W; Published: 8-Jun-2000; LatestRevisionDate: 17-Jul-2002; LatestRevisionNote: Re-released for DXP Platform.; PackageVersion: 1995/1996; PackageReference: E3; Publisher: Altium Limited; PackageDescription: TO, Flat Index; 3 In-Line, Axial Leads; Body Dia. 4.6mm; Lead Dia. 0.5 mm (max); RoHS: RoHS Compliant; Category: Discrete Semiconductor Products; Packaging: Cut Tape (CT); Mounting Type: Surface Mount; Package / Case: TO-252-3, DPak (2 Leads + Tab), SC-63; Supplier Device Package: PG-TO252-3; ComponentLink1URL: http://www.infineon.com/dgdl/Infineon-IPD075N03LG-DS-v02_01-en.pdf?folderId=5546d4694909da4801490a07012f053b&fileId=db3a30431936bc4b011951d824f83aeb; ComponentLink1Description: http://www.infineon.com/dgdl/Infineon-IPD075N03LG-DS-v02_01-en.pdf?folderId=5546d4694909da4801490a07012f053b&fileId=db3a30431936bc4b011951d824f83aeb; ComponentLink2URL: http://www.semicon.toshiba.co.jp/info/docget.jsp?type=datasheet&lang=en&pid=SSM3K329R; ComponentLink2Description: http://www.semicon.toshiba.co.jp/info/docget.jsp?type=datasheet&lang=en&pid=SSM3K329R; Supplier 1: Digi-Key
R59 = Res1: Published: 8-Jun-2000; LatestRevisionDate: 17-Jul-2002; LatestRevisionNote: Re-released for DXP Platform.; PackageReference: AXIAL-0.3; Publisher: Altium Limited; PackageDescription: Axial Device, Thru-Hole; 2 Leads; 0.3 in Pin Spacing; Value: 10K; Supplier 1: Digi-Key; Supplier Part Number 1: RMCF1206FT10K0CT-ND
R60 = Res1: KTR18EZPF1501: RES SMD 1.5K OHM 1% 1/4W 1206; Published: 8-Jun-2000; LatestRevisionDate: 17-Jul-2002; LatestRevisionNote: Re-released for DXP Platform.; PackageReference: AXIAL-0.3; Publisher: Altium Limited; PackageDescription: Axial Device, Thru-Hole; 2 Leads; 0.3 in Pin Spacing; Value: 10.7K; Supplier 1: Digi-Key; Supplier Part Number 1: RNCP1206FTD10K7CT-ND
R61 = Res1: KTR18EZPJ101: RES SMD 100 OHM 5% 1/4W 1206; Published: 8-Jun-2000; LatestRevisionDate: 17-Jul-2002; LatestRevisionNote: Re-released for DXP Platform.; PackageReference: AXIAL-0.3; Publisher: Altium Limited; PackageDescription: Axial Device, Thru-Hole; 2 Leads; 0.3 in Pin Spacing; Value: 100; Supplier 1: Digi-Key; Supplier Part Number 1: RHM100PCT-ND

## Nets that join several sheets
3V3: 2-FET Control (R9.2), 4-Power (C7.2 R20.1 U4.3), 8-Controller (14 pins), 9-Protections 1 of 2 (D13.2 D14.2 D15.2 D16.2), 10-Protections 2 of 2 (D17.2 D18.2 D19.2 D20.2)
3V3Ref: 4-Power (C8.2 Ref1.6), 8-Controller (U5.21)
5V: 2-FET Control (C1.1 U1.5), 4-Power (C6.2 R18.1 U3.3), 12-Charging LED Indicator (C29.2 COMP1.8 R59.1)
12V: 1-Connectors (5 pins), 2-FET Control (Q1.1 Q1.2 Q1.3 R8.2), 3-Fuses (6 pins), 4-Power (8 pins), 5-Latching Delay (8 pins), 10-Protections 2 of 2 (R51.1)
GND: 1-Connectors (9 pins), 2-FET Control (9 pins), 3-Fuses (5 pins), 4-Power (15 pins), 5-Latching Delay (5 pins), 6-Latching AMS (AMS1.24 Q8.2 Q9.2 R29.1), 7-Latching IMD (5 pins), 8-Controller (22 pins), 9-Protections 1 of 2 (12 pins), 10-Protections 2 of 2 (12 pins), 12-Charging LED Indicator (C29.1 COMP1.4 Q13.2 R60.1)
LATCHING_Delayed: 5-Latching Delay (Q5.5 Q5.6 Q5.7 Q5.8), 6-Latching AMS (5 pins), 7-Latching IMD (D10.2 D11.2 IMD1.A3 R34.1)
12V_TO_ENBLSW: 1-Connectors (FRONT_PANEL.12), 3-Fuses (D1.1 XF1.3 XF1.4)
~{AMS_OK}: 1-Connectors (AUX_TRAY_CONN.8), 6-Latching AMS (R28.1 R31.1)
AIR+_CTRL: 1-Connectors (AUX_TRAY_CONN.18), 2-FET Control (Q3.3)
AIR+_FB: 1-Connectors (AUX_TRAY_CONN.11), 10-Protections 2 of 2 (R55.1)
AIR-_CTRL: 1-Connectors (AUX_TRAY_CONN.17), 2-FET Control (Q4.3)
AIR-_FB: 1-Connectors (AUX_TRAY_CONN.12), 10-Protections 2 of 2 (R57.1)
AMS_CHR_PWR: 1-Connectors (AUX_TRAY_CONN.4), 3-Fuses (D7.1 XF3.3 XF3.4)
AMS_CHR_PWR_FUSE: 1-Connectors (12V_SW.3), 2-FET Control (Q1.5 Q1.6 Q1.7 Q1.8), 3-Fuses (XF3.1 XF3.2)
AMS_CHRG_CTRL: 2-FET Control (R9.1 R10.2 U1.1), 8-Controller (U5.40)
AMS_LED: 1-Connectors (FRONT_PANEL.3), 6-Latching AMS (AMS1.21)
AMS_OK: 6-Latching AMS (Q8.3 R26.2 R27.1), 9-Protections 1 of 2 (R47.1)
AMS_PWR: 1-Connectors (12V_SW.4 AUX_TRAY_CONN.6), 3-Fuses (D9.1 XF5.3 XF5.4)
AMS_RST: 1-Connectors (FRONT_PANEL.4), 6-Latching AMS (Q7.2 R29.2)
HV_CURR_SENS: 1-Connectors (AUX_TRAY_CONN.16), 9-Protections 1 of 2 (R43.2), 12-Charging LED Indicator (COMP1.3)
HVB_PWR: 1-Connectors (AUX_TRAY_CONN.7), 3-Fuses (D6.1 XF4.3 XF4.4)
IMD_LED: 1-Connectors (FRONT_PANEL.8), 7-Latching IMD (IMD1.21)
IMD_OK: 1-Connectors (AUX_TRAY_CONN.9), 7-Latching IMD (R32.1 R36.2 R37.1), 9-Protections 1 of 2 (R45.1)
IMD_PWR: 1-Connectors (AUX_TRAY_CONN.5), 3-Fuses (D8.1 XF2.3 XF2.4)
IMD_RESIST_IN: 1-Connectors (AUX_TRAY_CONN.15), 9-Protections 1 of 2 (R49.2)
IMD_RST: 1-Connectors (FRONT_PANEL.7), 7-Latching IMD (Q10.2 R33.2)
NetC21_2: 8-Controller (U5.34), 9-Protections 1 of 2 (C21.2 D13.3 R43.1 R44.2)
NetC22_2: 8-Controller (U5.51), 9-Protections 1 of 2 (C22.2 D14.3 R45.2 R46.2)
NetC23_2: 8-Controller (U5.52), 9-Protections 1 of 2 (C23.2 D15.3 R47.2 R48.2)
NetC24_2: 8-Controller (U5.93), 9-Protections 1 of 2 (C24.2 D16.3 R49.1 R50.2)
NetC25_2: 8-Controller (U5.17), 10-Protections 2 of 2 (C25.2 D17.3 R51.2 R52.2)
NetC26_2: 8-Controller (U5.59), 10-Protections 2 of 2 (C26.2 D18.3 R53.2 R54.2)
NetC27_2: 8-Controller (U5.54), 10-Protections 2 of 2 (C27.2 D19.3 R55.2 R56.2)
NetC28_2: 8-Controller (U5.53), 10-Protections 2 of 2 (C28.2 D20.3 R57.2 R58.2)
NetFRONT_PANEL_14: 1-Connectors (FRONT_PANEL.14), 12-Charging LED Indicator (Q13.3)
NetR13_1: 2-FET Control (R13.1), 8-Controller (U5.57)
NetR15_1: 2-FET Control (R15.1), 8-Controller (U5.56)
NetU2_1: 1-Connectors (WALL_CONN.1), 4-Power (U2.1)
NetU2_2: 1-Connectors (WALL_CONN.3), 4-Power (U2.2)
NetU2_4: 3-Fuses (XF1.1 XF1.2), 4-Power (U2.4)
NRST: 1-Connectors (STLINK.5), 8-Controller (P1.6 U5.14)
Serial_Rx: 1-Connectors (STLINK.3), 8-Controller (U5.87)
Serial_Tx: 1-Connectors (STLINK.2), 8-Controller (U5.86)
SHCT_AMS_IMD: 6-Latching AMS (AMS1.11), 7-Latching IMD (IMD1.12)
SHCT_IN: 1-Connectors (FRONT_PANEL.2), 6-Latching AMS (AMS1.12)
SHCT_INTERLOCK: 1-Connectors (AUX_TRAY_CONN.22), 7-Latching IMD (IMD1.11)
SHCT_OUT: 1-Connectors (AUX_TRAY_CONN.20 AUX_TRAY_CONN.21), 2-FET Control (R11.1 R11.2 R12.2 U1.2)
SHCT_TAP: 1-Connectors (AUX_TRAY_CONN.10), 10-Protections 2 of 2 (R53.1)
SWCLK: 1-Connectors (STLINK.1), 8-Controller (P1.4 U5.76)
SWDIO: 1-Connectors (STLINK.6), 8-Controller (P1.3 U5.72)